# Altium project MIXR Input System.PrjPcb (part 2 of 2)

## Sheet MIXR Input System - input.SchDoc
size B
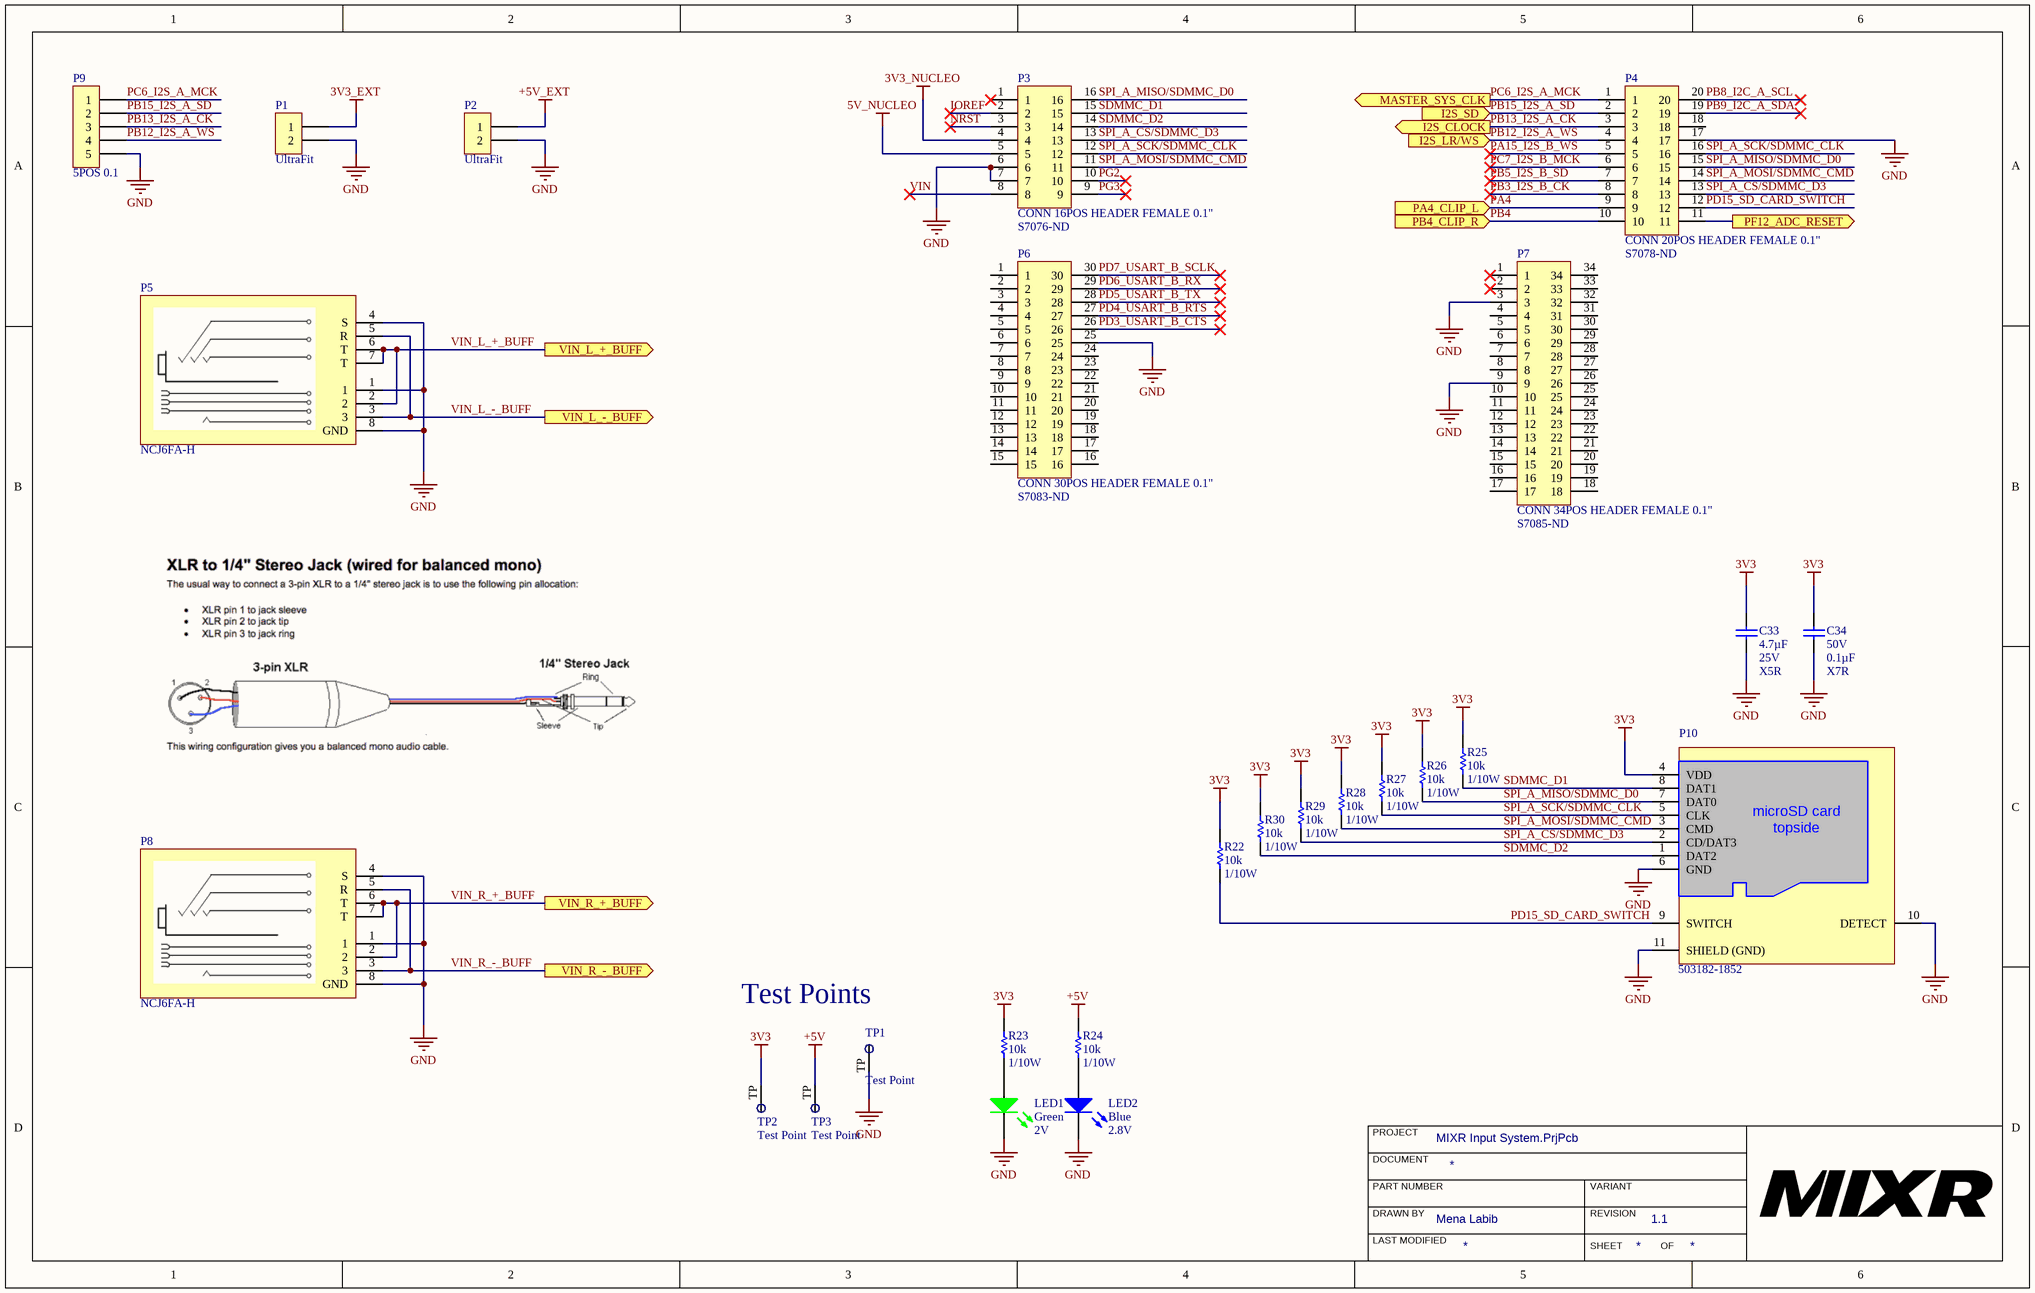
[diagram p2: MIXR Input System - input.SchDoc]

### Parts
C33  Capacitance: 4.7µF  Voltage: 25V  Temperature Coefficient: X5R  [CAP, 0603]  (hidden comment: CAP CER 4.7UF 25V 10% X5R 0603)
C34  Voltage: 50V  Capacitance: 0.1µF  Temperature Coefficient: X7R  [CAP, 0603]  (hidden comment: CAP CER 0.1UF 50V 10% X7R 0603)
LED1  Color: Green  Voltage - Forward (Vf) (Typ): 2V  [LED_0603]  (hidden comment: LED GREEN CLEAR 2V 0603)
LED2  Color: Blue  Voltage - Forward (Vf) (Typ): 2.8V  [LED_0603]  (hidden comment: LED BLUE CLEAR 2.8V 0603)
P1  Series: UltraFit  [CONN, 2POS ULTRA-FIT]  (hidden comment: CONN 2POS ULTRA-FIT 0.138")
P2  Series: UltraFit  [CONN, 2POS ULTRA-FIT]  (hidden comment: CONN 2POS ULTRA-FIT 0.138")
P3  CONN 16POS HEADER FEMALE 0.1"  Supplier Part Number 1: S7076-ND  [CONN, 16POS 0.100" Header]
P4  CONN 20POS HEADER FEMALE 0.1"  Supplier Part Number 1: S7078-ND  [CONN, 20POS 0.100" HEADER]
P5  Manufacturer Part Number: NCJ6FA-H  [CONN XLR-TRS COMBO 3 POLE]  (hidden comment: CONN XLR-TRS COMBO 3 POLE)
P6  CONN 30POS HEADER FEMALE 0.1"  Supplier Part Number 1: S7083-ND  [CONN, 30POS 0.100" HEADER]
P7  CONN 34POS HEADER FEMALE 0.1"  Supplier Part Number 1: S7085-ND  [CONN, 34POS 0.100" HEADER]
P8  Manufacturer Part Number: NCJ6FA-H  [CONN XLR-TRS COMBO 3 POLE]  (hidden comment: CONN XLR-TRS COMBO 3 POLE)
P9  5POS 0.1  [CONN, 5POS HEADR 0.1"]
P10  Manufacturer Part Number: 503182-1852  [CONN MICRO-SD HOLDER MOLEX 503182-1852]  (hidden comment: CONN MICRO-SD ULTRA-LOW 8CKT)
R22  Resistance: 10k  Power: 1/10W  [RES, 0603]  (hidden comment: RES 10K OHM 1% 1/10W 0603)
R23  Resistance: 10k  Power: 1/10W  [RES, 0603]  (hidden comment: RES 10K OHM 1% 1/10W 0603)
R24  Resistance: 10k  Power: 1/10W  [RES, 0603]  (hidden comment: RES 10K OHM 1% 1/10W 0603)
R25  Resistance: 10k  Power: 1/10W  [RES, 0603]  (hidden comment: RES 10K OHM 1% 1/10W 0603)
R26  Resistance: 10k  Power: 1/10W  [RES, 0603]  (hidden comment: RES 10K OHM 1% 1/10W 0603)
R27  Resistance: 10k  Power: 1/10W  [RES, 0603]  (hidden comment: RES 10K OHM 1% 1/10W 0603)
R28  Resistance: 10k  Power: 1/10W  [RES, 0603]  (hidden comment: RES 10K OHM 1% 1/10W 0603)
R29  Resistance: 10k  Power: 1/10W  [RES, 0603]  (hidden comment: RES 10K OHM 1% 1/10W 0603)
R30  Resistance: 10k  Power: 1/10W  [RES, 0603]  (hidden comment: RES 10K OHM 1% 1/10W 0603)
TP1  Test Point  [Test Point]  (no BOM)
TP2  Test Point  [Test Point]  (no BOM)
TP3  Test Point  [Test Point]  (no BOM)

### Ports
I2S_CLOCK (out), I2S_LR/WS (in), I2S_SD (in), MASTER_SYS_CLK (out), PA4_CLIP_L (in), PB4_CLIP_R (in), PF12_ADC_RESET (out), VIN_L_+_BUFF (out), VIN_L_-_BUFF (out), VIN_R_+_BUFF (out), VIN_R_-_BUFF (out)

### Nets
3V3: C33.1 C34.2 P10.4(VDD) R22.2 R23.1 R25.2 R26.2 R27.2 R28.2 R29.2 R30.2 TP2.TP
3V3_EXT: P1.1
3V3_NUCLEO: P3.4
5V_NUCLEO: P3.5
+5V: R24.1 TP3.TP
+5V_EXT: P2.1
GND: C33.2 C34.1 LED1.2(K) LED2.2(K) P1.2 P2.2 P3.6 P3.7 P4.17 P5.1 P5.4(S) P5.8(GND) P6.25 P7.3 P7.9 P8.1 P8.4(S) P8.8(GND) P9.5 P10.6(GND) P10.10(DETECT) P10.11(SHIELD_(GND)) TP1.TP
IOREF: P3.2
NRST: P3.3
PA4: P4.9 ; port PA4_CLIP_L
PA15_I2S_B_WS: P4.5
PB3_I2S_B_CK: P4.8
PB4: P4.10 ; port PB4_CLIP_R
PB5_I2S_B_SD: P4.7
PB8_I2C_A_SCL: P4.20
PB9_I2C_A_SDA: P4.19
PB12_I2S_A_WS: P4.4 P9.4 ; port I2S_LR/WS
PB13_I2S_A_CK: P4.3 P9.3 ; port I2S_CLOCK
PB15_I2S_A_SD: P4.2 P9.2 ; port I2S_SD
PC6_I2S_A_MCK: P4.1 P9.1 ; port MASTER_SYS_CLK
PC7_I2S_B_MCK: P4.6
PD3_USART_B_CTS: P6.26
PD4_USART_B_RTS: P6.27
PD5_USART_B_TX: P6.28
PD6_USART_B_RX: P6.29
PD7_USART_B_SCLK: P6.30
PD15_SD_CARD_SWITCH: P4.12 P10.9(SWITCH) R22.1
PG2: P3.10
PG3: P3.9
SDMMC_D1: P3.15 P10.8(DAT1) R25.1
SDMMC_D2: P3.14 P10.1(DAT2) R30.1
SPI_A_CS/SDMMC_D3: P3.13 P4.13 P10.2(CD/DAT3) R29.1
SPI_A_MISO/SDMMC_D0: P3.16 P4.15 P10.7(DAT0) R26.1
SPI_A_MOSI/SDMMC_CMD: P3.11 P4.14 P10.3(CMD) R28.1
SPI_A_SCK/SDMMC_CLK: P3.12 P4.16 P10.5(CLK) R27.1
VIN: P3.8
VIN_L_+_BUFF: P5.2 P5.6(T) P5.7(T) ; port VIN_L_+_BUFF
VIN_L_-_BUFF: P5.3 P5.5(R) ; port VIN_L_-_BUFF
VIN_R_+_BUFF: P8.2 P8.6(T) P8.7(T) ; port VIN_R_+_BUFF
VIN_R_-_BUFF: P8.3 P8.5(R) ; port VIN_R_-_BUFF
NetLED1_1: LED1.1(A) R23.2
NetLED2_1: LED2.1(A) R24.2
NetP4_11: P4.11 ; port PF12_ADC_RESET

Not connected (* = marked no-connect by the designer): P3 1*; P4 18; P6 1 2 3 4 5 6 7 8 9 10 11 12 13 14 15 16 17 18 19 20 21 22 23 24; P7 1* 2* 4 5 6 7 8 10 11 12 13 14 15 16 17 18 19 20 21 22 23 24 25 26 27 28 29 30 31 32 33 34

### Notes on the sheet
- (near TP1) Test Points
- PROJECT
- DOCUMENT
- DRAWN BY
- LAST MODIFIED
- PART NUMBER
- REVISION
- SHEET
- VARIANT
- OF
- (in symbol CONN MICRO-SD ULTRA-LOW 8CKT) microSD card / topside

### Library data of the parts
C33 = CAP CER 4.7UF 25V 10% X5R 0603: 4.7µF ±10% 25V Ceramic Capacitor X5R 0603 (1608 Metric); Manufacturer 1: Murata Electronics North America; Manufacturer Part Number 1: GRM188R61E475KE11D; Supplier 1: Digi-Key; Supplier Part Number 1: 490-7203-1-ND; Packaging: Cut Tape (CT); Part Status: Active; Operating Temperature: -55°C ~ 85°C; Ratings: -; Mounting Type: Surface Mount, MLCC; Package / Case: 0603 (1608 Metric); Size / Dimension: 0.063" L x 0.031" W (1.60mm x 0.80mm); Height - Seated (Max): -; Thickness (Max): 0.031" (0.80mm); Lead Spacing: -; Lead Style: -; ComponentLink1URL: http://www.murata.com/~/media/webrenewal/support/library/catalog/products/capacitor/mlcc/c02e.ashx; ComponentLink1Description: http://www.murata.com/~/media/webrenewal/support/library/catalog/products/capacitor/mlcc/c02e.ashx; Tolerance: ±10%
C34 = CAP CER 0.1UF 50V 10% X7R 0603: 0.10µF ±10% 50V Ceramic Capacitor X7R 0603 (1608 Metric); Manufacturer 1: AVX Corporation; Manufacturer Part Number 1: 06035C104KAT2A; Supplier 1: Digi-Key; Supplier Part Number 1: 478-5052-1-ND; Packaging: Cut Tape (CT); Part Status: Active; Operating Temperature: -55°C ~ 125°C; Ratings: -; Mounting Type: Surface Mount, MLCC; Package / Case: 0603 (1608 Metric); Size / Dimension: 0.063" L x 0.032" W (1.60mm x 0.81mm); Height - Seated (Max): -; Thickness (Max): 0.035" (0.90mm); Lead Spacing: -; Lead Style: -; ComponentLink1URL: http://datasheets.avx.com/X7RDielectric.pdf; ComponentLink1Description: http://datasheets.avx.com/X7RDielectric.pdf; Tolerance: ±10%
LED1 = LED GREEN CLEAR 2V 0603: Green 572nm LED Indication - Discrete 2V 0603 (1608 Metric); Manufacturer: Wurth Electronics Inc.; Manufacturer Part Number: 150060VS75000; Lens Color: Colorless; Millicandela Rating: 40mcd; Lens Style/Size: Rectangle with Flat Top, 1.10mm x 0.70mm; Current - Test: 20mA; Viewing Angle: 140°; Wavelength - Dominant: 570nm; Supplier 1: Digi-Key; RoHS: RoHS Compliant; Category: Optoelectronics; Stock 1: 9408; Pricing 1: 1=0.21, 100=0.1617, 500=0.13964 (CAD); Packaging: Cut Tape (CT); Part Status: Active; Lens Transparency: Clear; Mounting Type: Surface Mount; Wavelength - Peak: 572nm; Features: -; Package / Case: 0603 (1608 Metric); Supplier Device Package: 0603; Size / Dimension: 1.60mm L x 0.80mm W; Height (Max): 0.80mm; ComponentLink1URL: http://katalog.we-online.de/led/datasheet/150060VS75000.pdf; ComponentLink1Description: http://katalog.we-online.de/led/datasheet/150060VS75000.pdf; Supplier Part Number 1: 732-4980-1-ND
LED2 = LED BLUE CLEAR 2.8V 0603: Blue 470nm LED Indication - Discrete 2.8V 0603 (1608 Metric); Manufacturer 1: Lite-On Inc.; Manufacturer Part Number 1: LTST-C193TBKT-5A; Lens Color: Colorless; Millicandela Rating: 15mcd; Lens Style/Size: Rectangle with Flat Top, 1.15mm x 0.80mm; Current - Test: 5mA; Viewing Angle: 130°; Wavelength - Peak: 468nm; Supplier 1: Digi-Key; Supplier Part Number 1: 160-1827-1-ND; Packaging: Cut Tape (CT); Part Status: Active; Lens Transparency: Clear; Mounting Type: Surface Mount; Wavelength - Dominant: 470nm; Package / Case: 0603 (1608 Metric); Supplier Device Package: Chip LED; Size / Dimension: 1.60mm L x 0.80mm W; Height (Max): 0.45mm; ComponentLink1URL: http://optoelectronics.liteon.com/upload/download/DS22-2004-060/P_100_LTST-C193TBKT-5A.pdf; ComponentLink1Description: http://optoelectronics.liteon.com/upload/download/DS22-2004-060/P_100_LTST-C193TBKT-5A.pdf
P1 P2 = CONN 2POS ULTRA-FIT 0.138": Connector Header Through Hole 2 position 0.138" (3.50mm); Manufacturer: Molex; Manufacturer Part Number: 1722871102; Number of Positions: 2; Connector Type: Male Pin; Pitch: 0.138inch; ComponentLink1URL: http://www.molex.com/pdm_docs/sd/1722861302_sd.pdf; ComponentLink1Description: http://www.molex.com/pdm_docs/sd/1722861302_sd.pdf; Supplier 1: Digi-Key; RoHS: Yes; Stock 1: 2743; Pricing 1: 1 = 0.78000, 10 = 0.68800, 100 = 0.59380, 500 = 0.48582, 1000 = 0.43184, 5000 = 0.37786, 10000 = 0.35897 (USD); Mount: Through Hole; Color: Black; Contact Plating: Tin; Packaging: Tray; Number of Rows: 1; Termination: Solder; Fastening Type: Latch; Supplier Part Number 1: WM11701-ND
P3 = CONN 16POS HEADER FEMALE 0.1": 16 Position Header Connector 0.100" (2.54mm) Through Hole Tin; Manufacturer: Sullins; Manufacturer Part Number: PPTC082LFBN-RC; Number of Positions: 16; Pitch: 0.1inch; Supplier 1: Digi-Key; RoHS: Yes; Stock 1: 4232; Pricing 1: 1 = 0.99000, 10 = 0.87000, 100 = 0.75040, 500 = 0.61398, 1000 = 0.54576, 5000 = 0.49270 (USD); Mount: Through Hole; Color: Black; Contact Plating: Tin; Contact Material: Bronze; Housing Material: Plastic; Package Quantity: 1000; Number of Rows: 2; Packaging: Bulk; Termination: Solder; Connector Type: Header; Length: 20.8mm; Height: 8.5mm; Row Spacing: 0.1inch; Width: 5mm; Lead Free: Lead Free; ComponentLink1URL: http://www.sullinscorp.com/catalogs/101_Page80-81_HEADER_.100_2.54mm_FEMALE.pdf?src-supplier=Future+Electronics; ComponentLink1Description: http://www.sullinscorp.com/catalogs/101_Page80-81_HEADER_.100_2.54mm_FEMALE.pdf?src-supplier=Future+Electronics; ComponentLink2URL: https://drawings-pdf.s3.amazonaws.com/10492.pdf?src-supplier=Digi-Key; ComponentLink2Description: https://drawings-pdf.s3.amazonaws.com/10492.pdf?src-supplier=Digi-Key
P4 = CONN 20POS HEADER FEMALE 0.1": 20 Position Header Connector 0.100" (2.54mm) Through Hole Tin; Manufacturer: Sullins; Manufacturer Part Number: PPTC102LFBN-RC; Number of Positions: 20; Pitch: 0.1inch; Supplier 1: Digi-Key; RoHS: Yes; Stock 1: 4161; Pricing 1: 1 = 1.30000, 10 = 1.14500, 100 = 0.98800, 500 = 0.80838, 1000 = 0.71856, 5000 = 0.64870 (USD); Mount: Through Hole; Color: Black; Contact Plating: Tin; Contact Material: Bronze; Housing Material: Plastic; Package Quantity: 1000; Number of Rows: 2; Packaging: Bulk; Termination: Solder; Connector Type: Header; Length: 25.9mm; Height: 8.5mm; Row Spacing: 0.1inch; Width: 5mm; Lead Free: Lead Free; ComponentLink1URL: http://www.sullinscorp.com/catalogs/101_Page80-81_HEADER_.100_2.54mm_FEMALE.pdf?src-supplier=Future+Electronics; ComponentLink1Description: http://www.sullinscorp.com/catalogs/101_Page80-81_HEADER_.100_2.54mm_FEMALE.pdf?src-supplier=Future+Electronics; ComponentLink2URL: https://media.digikey.com/pdf/Data%20Sheets/Sullins%20PDFs/Female_Headers.100_DS.pdf?src-supplier=Digi-Key; ComponentLink2Description: https://media.digikey.com/pdf/Data%20Sheets/Sullins%20PDFs/Female_Headers.100_DS.pdf?src-supplier=Digi-Key
P5 P8 = CONN XLR-TRS COMBO 3 POLE: XLR Connectors A SERIES COMBO;3POLE FEM;PCB HOR; Manufacturer_Name: Neutrik; Body Material: Metal; Gender: Female; Current Rating: 3A; Voltage Rating: 50V; Number of Positions: 3; Number of Ports: 1; Number of Contacts: 6; Connector Type: Socket; Datasheet Link: http://www.neutrik.com/zoolu-website/media/download/13540/Product+Guide+-+Section+XLR; Manufacturer_Part_Number: NCJ6FA-H; Mouser Part Number: 568-NCJ6FA-H; Mouser Price/Stock: https://www.mouser.com/Search/Refine.aspx?Keyword=568-NCJ6FA-H; Supplier 1: Mouser; Supplier Part Number 1: 568-NCJ6FA-H; Manufacturer: Neutrik; Stock 1: 3848; Pricing 1: 1 = 2.06000, 10 = 1.96000, 50 = 1.86000, 100 = 1.80000, 1000 = 1.77000, 10000 = 1.77000 (USD); RoHS: Yes; Case/Package: Metal; Number of Pins: 3; Weight: 0.388014oz; Contact Material: Bronze; Contact Plating: Gold; Number of Terminals: 6; Housing Material: Polyamide; Color: Black; Min Operating Temperature: -30°C; Max Operating Temperature: 80°C; Package Quantity: 10; Termination: Solder; Orientation: Horizontal; Length: 25mm; Depth: 30.2mm; REACH SVHC: No SVHC; Flammability Rating: UL94 HB; ComponentLink1URL: https://datasheet.ciiva.com/30126/neutrik-ncj6fa-h-1-30126129.pdf?src-supplier=Onlinecomponents.com; ComponentLink1Description: https://datasheet.ciiva.com/30126/neutrik-ncj6fa-h-1-30126129.pdf?src-supplier=Onlinecomponents.com; ComponentLink2URL: https://datasheet.ciiva.com/8008/76755-8008003.pdf?src-supplier=Element14; ComponentLink2Description: https://datasheet.ciiva.com/8008/76755-8008003.pdf?src-supplier=Element14; ComponentLink3URL: https://datasheet.ciiva.com/24394/neutrik-ncj6fa-h-1-24394955.pdf?src-supplier=Onlinecomponents.com; ComponentLink3Description: https://datasheet.ciiva.com/24394/neutrik-ncj6fa-h-1-24394955.pdf?src-supplier=Onlinecomponents.com
P6 = CONN 30POS HEADER FEMALE 0.1": 30 Position Header Connector 0.100" (2.54mm) Through Hole Tin; Manufacturer: Sullins; Manufacturer Part Number: PPTC152LFBN-RC; Number of Positions: 30; Pitch: 0.1inch; Supplier 1: Digi-Key; RoHS: Yes; Stock 1: 3515; Pricing 1: 1 = 1.82000, 10 = 1.65200, 100 = 1.41560, 500 = 1.17968, 1000 = 1.01115, 5000 = 0.97370 (USD); Mount: Through Hole; Color: Black; Contact Plating: Tin; Contact Material: Bronze; Housing Material: Plastic; Package Quantity: 1000; Number of Rows: 2; Packaging: Bulk; Termination: Solder; Connector Type: Header; Length: 38.6mm; Height: 8.5mm; Row Spacing: 0.1inch; Width: 5mm; Lead Free: Lead Free; ComponentLink1URL: https://media.digikey.com/pdf/Data%20Sheets/Sullins%20PDFs/Female_Headers.100_DS.pdf?src-supplier=Digi-Key; ComponentLink1Description: https://media.digikey.com/pdf/Data%20Sheets/Sullins%20PDFs/Female_Headers.100_DS.pdf?src-supplier=Digi-Key
P7 = CONN 34POS HEADER FEMALE 0.1": 34 Position Header Connector 0.100" (2.54mm) Through Hole Tin; Manufacturer: Sullins; Manufacturer Part Number: PPTC172LFBN-RC; Number of Positions: 34; Pitch: 0.1inch; Supplier 1: Digi-Key; RoHS: Yes; Stock 1: 1849; Pricing 1: 1 = 1.94000, 10 = 1.76400, 100 = 1.51200, 500 = 1.26000, 1000 = 1.08000, 5000 = 1.04000 (USD); Mount: Through Hole; Color: Black; Contact Plating: Tin; Contact Material: Bronze; Housing Material: Plastic; Package Quantity: 1000; Number of Rows: 2; Packaging: Bulk; Termination: Solder; Connector Type: Header; Length: 43.7mm; Height: 8.5mm; Row Spacing: 0.1inch; Width: 5mm; Lead Free: Lead Free; ComponentLink1URL: https://media.digikey.com/pdf/Data%20Sheets/Sullins%20PDFs/Female_Headers.100_DS.pdf?src-supplier=Digi-Key; ComponentLink1Description: https://media.digikey.com/pdf/Data%20Sheets/Sullins%20PDFs/Female_Headers.100_DS.pdf?src-supplier=Digi-Key
P9 = CONN 5POS HEADR MALE 0.1in: 5 Positions Header, Breakaway Connector 0.100" (2.54mm) Through Hole Tin; Manufacturer 1: Molex; Manufacturer Part Number 1: 0022284050; Description 1: Conn Unshrouded Header HDR 5 POS 2.54mm Solder ST Thru-Hole KK® Bag; Contact Resistance: 20mR; Number of Positions: 5; Gender: Male; Connector Type: Male Pin; Max Voltage Rating (AC): 250V; Supplier 1: Digi-Key; Supplier Part Number 1: WM50014-05-ND; Stock 1: 3161; Pricing 1: 1=0.22, 10=0.21, 25=0.1796, 50=0.157, 100=0.1459, 250=0.129, 500=0.1234 (USD); Mount: Through Hole; Colour: Black; Contact Plating: Nickel,Tin; Contact Material: Bronze,Brass; Housing Colour: Black; Housing Material: Nylon; Min Operating Temperature: 0°C; Max Operating Temperature: 75°C; Packaging: Bulk; Number of Rows: 1; Termination: Solder; Number of Contacts: 5; Orientation: Straight; Max Voltage Rating (DC): 250V; Length: 12.7mm; Pitch: 2.54mm; Depth: 2.49mm; Contact Mating Length: 0.24inch; ComponentLink1URL: https://datasheet.ciiva.com/6814/022284363-sd-6814049.pdf; ComponentLink1Description: https://datasheet.ciiva.com/6814/022284363-sd-6814049.pdf; ComponentLink2URL: https://datasheet.ciiva.com/14804/179390022284050-pcb-headers-14804361.pdf; ComponentLink2Description: https://datasheet.ciiva.com/14804/179390022284050-pcb-headers-14804361.pdf; ComponentLink3URL: https://datasheet.ciiva.com/15217/getdatasheetpartid-256138-15217709.pdf; ComponentLink3Description: https://datasheet.ciiva.com/15217/getdatasheetpartid-256138-15217709.pdf
P10 = CONN MICRO-SD ULTRA-LOW 8CKT: 9 (8 + 1) Position Card Connector microSD™ Surface Mount, Right Angle Gold /; Manufacturer: Molex; Gender: Male; Number of Circuits: 8; Pitch: 1.1mm; Supplier 1: Digi-Key; RoHS: Yes; Stock 1: 36042; Pricing 1: 1 = 2.45000, 10 = 2.22400, 25 = 2.08840, 50 = 1.99740, 100 = 1.90670, 250 = 1.72508, 500 = 1.58890 (USD); Mount: Surface Mount; Contact Material: Copper Alloy; Contact Plating: Gold; Housing Material: Polymer; Min Operating Temperature: -25°C; Max Operating Temperature: 85°C; Number of Rows: 1; Package Quantity: 1600; Packaging: Tape and Reel; Connector Type: Connector; Termination: Solder; Orientation: Right Angle; Length: 15.2mm; Depth: 14.95mm; REACH SVHC: No SVHC; Halogen Free: Low Halogen; Supplier Part Number 1: WM12834CT-ND
R22-R30 = RES 10K OHM 1% 1/10W 0603: RES SMD 10K OHM 1% 1/10W 0603; Manufacturer 1: Yageo; Manufacturer Part Number 1: RC0603FR-0710KL; Temperature Coefficient: ±100ppm/°C; Supplier 1: Digi-Key; Supplier Part Number 1: 311-10.0KHRCT-ND; Packaging: Cut Tape (CT); Part Status: Active; Composition: Thick Film; Operating Temperature: -55°C ~ 155°C; Package / Case: 0603 (1608 Metric); Supplier Device Package: 0603; Size / Dimension: 0.063" L x 0.031" W (1.60mm x 0.80mm); Height - Seated (Max): 0.022" (0.55mm); Failure Rate: -; ComponentLink1URL: http://www.yageo.com/documents/recent/PYu-RC_Group_51_RoHS_L_7.pdf; ComponentLink1Description: http://www.yageo.com/documents/recent/PYu-RC_Group_51_RoHS_L_7.pdf; Tolerance: ±1%

## Nets that join several sheets
3V3: MIXR Input System - Power&Control (11 pins), MIXR Input System - input (12 pins)
3V3_EXT: MIXR Input System - Power&Control (U4.1 U4.3), MIXR Input System - input (P1.1)
3V3_NUCLEO: MIXR Input System - Power&Control (U7.1 U7.3), MIXR Input System - input (P3.4)
5V_NUCLEO: MIXR Input System - Power&Control (U6.1 U6.3), MIXR Input System - input (P3.5)
+5V: MIXR Input System - Power&Control (10 pins), MIXR Input System - Buffer (12 pins), MIXR Input System - input (R24.1 TP3.TP)
+5V_EXT: MIXR Input System - Power&Control (U5.1 U5.3), MIXR Input System - input (P2.1)
-5V: MIXR Input System - Power&Control (C23.1 C35.1 C36.1 U8.5), MIXR Input System - Buffer (U2.6 U2.9 U3.6 U3.9)
GND: MIXR Input System - Power&Control (25 pins), MIXR Input System - Buffer (22 pins), MIXR Input System - input (23 pins)
NetP4_11: MIXR Input System - Power&Control (U1.19), MIXR Input System - input (P4.11)
PA4: MIXR Input System - Buffer (U1.21), MIXR Input System - input (P4.9)
PB4: MIXR Input System - Buffer (U1.20), MIXR Input System - input (P4.10)
PB12_I2S_A_WS: MIXR Input System - Power&Control (U1.17), MIXR Input System - input (P4.4 P9.4)
PB13_I2S_A_CK: MIXR Input System - Power&Control (U1.16), MIXR Input System - input (P4.3 P9.3)
PB15_I2S_A_SD: MIXR Input System - Power&Control (U1.15), MIXR Input System - input (P4.2 P9.2)
PC6_I2S_A_MCK: MIXR Input System - Power&Control (U1.18), MIXR Input System - input (P4.1 P9.1)
VIN_L_+_BUFF: MIXR Input System - Buffer (R2.1), MIXR Input System - input (P5.2 P5.6 P5.7)
VIN_L_-_BUFF: MIXR Input System - Buffer (R5.1), MIXR Input System - input (P5.3 P5.5)
VIN_R_+_BUFF: MIXR Input System - Buffer (R9.1), MIXR Input System - input (P8.2 P8.6 P8.7)
VIN_R_-_BUFF: MIXR Input System - Buffer (R12.1), MIXR Input System - input (P8.3 P8.5)

## Assembly variants
Standard: not fitted C35 C36